# Altium project EMP_Drone_Flight_Controller.PrjPcb
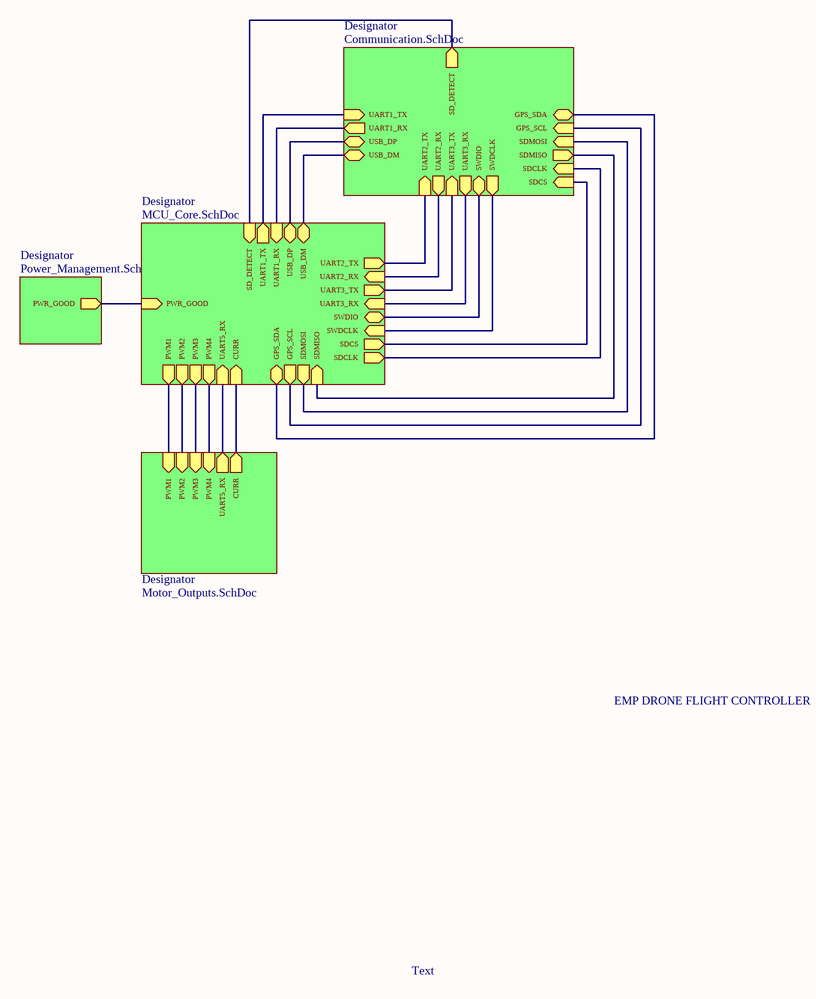
[diagram p0: EMP_FC_Main.SchDoc]
5 sheets, 105 parts. Net scope: hierarchical (ports join the sheet entries above them; power ports are global).
Board file: EMP_FC_PCB1.PcbDoc
Sheets:
  EMP_FC_Main.SchDoc
    Designator = Power_Management.SchDoc
    Designator = MCU_Core.SchDoc
    Designator = Communication.SchDoc
    Designator = Motor_Outputs.SchDoc

## Sheet EMP_FC_Main.SchDoc
size A4; SheetNumber: 1; SheetTotal: 5

### Sub-sheets
Designator = Power_Management.SchDoc: PWR_GOOD (out)
Designator = MCU_Core.SchDoc: UART1_TX (out), UART1_RX (in), USB_DM (bidir), USB_DP (bidir), PWM4 (out), PWM3 (out), PWM2 (out), PWM1 (out), PWR_GOOD (in), UART5_RX (in), UART2_TX (out), UART3_TX (out), SWDIO (bidir), UART2_RX (in), UART3_RX (in), SWDCLK (in), CURR (in), SDCS (out), SDCLK (out), SDMISO (in), SDMOSI (out), GPS_SDA (bidir), GPS_SCL (out), SD_DETECT (in)
Designator = Communication.SchDoc: UART1_TX (in), UART1_RX (out), USB_DP (bidir), USB_DM (bidir), UART2_RX (out), UART3_RX (out), SWDCLK (out), UART2_TX (in), UART3_TX (in), SWDIO (bidir), SDCS (in), SDCLK (in), SDMISO (out), SDMOSI (in), GPS_SCL (in), GPS_SDA (bidir), SD_DETECT (out)
Designator = Motor_Outputs.SchDoc: PWM1 (in), PWM2 (in), PWM3 (in), PWM4 (in), UART5_RX (out), CURR (out)

### Nets
CURR: sheet Designator/CURR, sheet Designator/CURR
D_N: sheet Designator/USB_DM, sheet Designator/USB_DM
D_P: sheet Designator/USB_DP, sheet Designator/USB_DP
GPS_SCL: sheet Designator/GPS_SCL, sheet Designator/GPS_SCL
GPS_SDA: sheet Designator/GPS_SDA, sheet Designator/GPS_SDA
SDCLK: sheet Designator/SDCLK, sheet Designator/SDCLK
SDCS: sheet Designator/SDCS, sheet Designator/SDCS
SDMISO: sheet Designator/SDMISO, sheet Designator/SDMISO
SDMOSI: sheet Designator/SDMOSI, sheet Designator/SDMOSI
SWCLK: sheet Designator/SWDCLK, sheet Designator/SWDCLK
SWDIO: sheet Designator/SWDIO, sheet Designator/SWDIO
UART1_RX: sheet Designator/UART1_RX, sheet Designator/UART1_RX
UART1_TX: sheet Designator/UART1_TX, sheet Designator/UART1_TX
UART2_RX: sheet Designator/UART2_RX, sheet Designator/UART2_RX
UART2_TX: sheet Designator/UART2_TX, sheet Designator/UART2_TX
UART3_RX: sheet Designator/UART3_RX, sheet Designator/UART3_RX
UART3_TX: sheet Designator/UART3_TX, sheet Designator/UART3_TX
UART5_RX: sheet Designator/UART5_RX, sheet Designator/UART5_RX
NetJ8_SWB: sheet Designator/SD_DETECT, sheet Designator/SD_DETECT
NetR8_1: sheet Designator/PWM1, sheet Designator/PWM1
NetR9_1: sheet Designator/PWM2, sheet Designator/PWM2
NetR10_1: sheet Designator/PWM3, sheet Designator/PWM3
NetR11_1: sheet Designator/PWM4, sheet Designator/PWM4
NetU2_98: sheet Designator/PWR_GOOD, sheet Designator/PWR_GOOD

### Notes on the sheet
- EMP DRONE FLIGHT CONTROLLER
- Text

## Sheet Power_Management.SchDoc
size A3; SheetNumber: 2; SheetTotal: 5
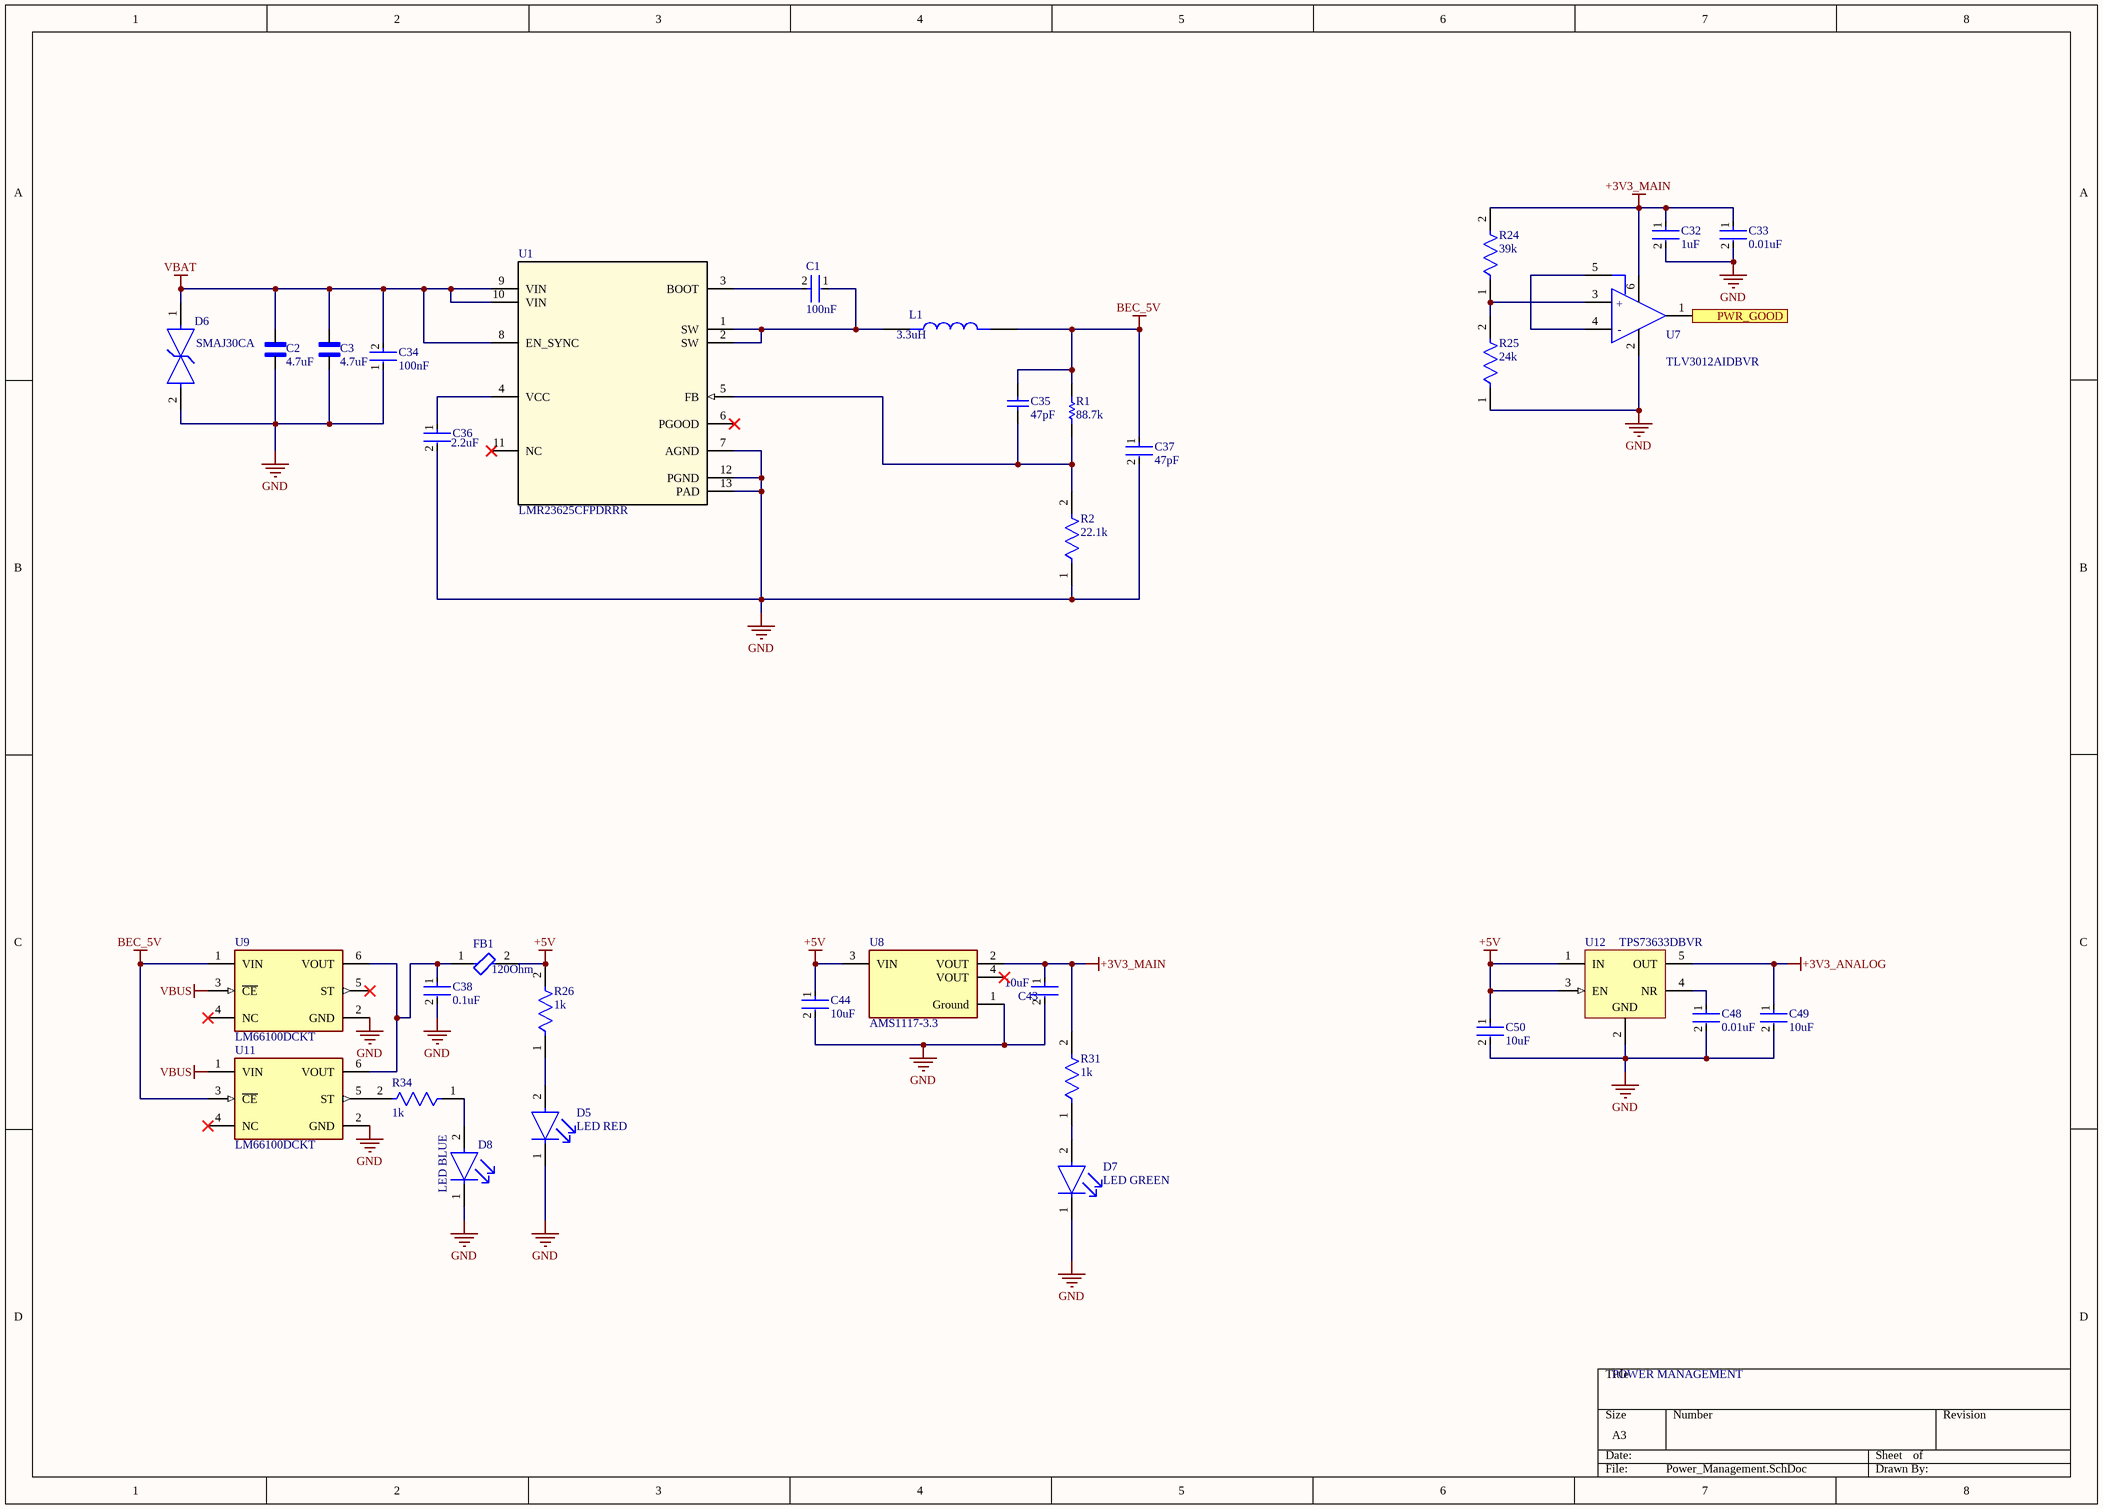
[diagram p1: Power_Management.SchDoc]

### Parts
C1  100nF  [FP-GRM15-MFG]
C2  4.7uF  [CAPC3225X270N]
C3  4.7uF  [CAPC3225X270N]
C32  1uF  [FP-GRM155-0_05-IPC_C]
C33  0.01uF  [FP-GRM022-0_02-IPC_B]
C34  100nF  [FP-C1608-080-0_1-IPC_A]
C35  47pF  [CAPC1005X55X25NL05T10]
C36  2.2uF  [FP-C1005-050-0_05-IPC_A]
C37  47pF  [FP-GRM31C-0_2-e0_3_0_8-IPC_A]
C38  0.1uF  [FP-C0402-BB-MFG]
C43  10uF  [FP-C0402C106M9PACTU-MFG]
C44  10uF  [FP-C0402C106M9PACTU-MFG]
C48  0.01uF  [FP-GRM022-0_02-IPC_B]
C49  10uF  [FP-C0402C106M9PACTU-MFG]
C50  10uF  [FP-C0402C106M9PACTU-MFG]
D5  LED RED  [FP-SML-LXT0805IW-TR-MFG]
D6  SMAJ30CA  [FP-SMAJ-CA-MFG]
D7  LED GREEN  [FP-LTST-C171GKT-MFG]
D8  LED BLUE  [FP-LTST-C191TBKT-MFG]
FB1  120Ohm  [FP-BLM31-0_2-t1_1-MFG]
L1  3.3uH  [IND_XAL4030-332MEB]
R1  88.7k  [RESC1005X40X25NL05T05]
R2  22.1k  [FP-CRCW0402-e3-IPC_A]
R24  39k  [FP-MCS0402-IPC_A]
R25  24k  [FP-CRCW0402-Pe3-IPC_C]
R26  1k  [FP-MCS0402-IPC_A]
R31  1k  [FP-MCS0402-IPC_A]
R34  1k  [FP-MCS0402-IPC_A]
U1  LMR23625CFPDRRR  [DRR0012D]
U7  TLV3012AIDBVR  [FP-DBV0006A-IPC_B]
U8  AMS1117-3.3  [FP-AMS1117-IPC_C]
U9  LM66100DCKT  [FP-DCK0006A-MFG]
U11  LM66100DCKT  [FP-DCK0006A-MFG]
U12  TPS73633DBVR  [DBV0005A_L]

### Ports
PWR_GOOD (out, see EMP_FC_Main[2C], MCU_Core[3B])

### Nets
+3V3_ANALOG: C49.1 U12.5(OUT)
+3V3_MAIN: C32.1 C33.1 C43.1 R24.2 R31.2 U7.6(V+) U8.2(VOUT)
+5V: C44.1 C50.1 FB1.2 R26.2 U8.3(VIN) U12.1(IN) U12.3(EN)
BEC_5V: C35.2 C37.1 L1.2 R1.2 U9.1(VIN) U11.3(~{CE})
GND: C2.1 C3.1 C32.2 C33.2 C34.1 C36.2 C37.2 C38.2 C43.2 C44.2 C48.2 C49.2 C50.2 D5.1(C) D6.2 D7.1(C) D8.1(C) R2.1 R25.1 U1.7(AGND) U1.12(PGND) U1.13(PAD) U7.2(V-) U8.1(Ground) U9.2(GND) U11.2(GND) U12.2(GND)
VBAT: C2.2 C3.2 C34.2 D6.1 U1.8(EN_SYNC) U1.9(VIN) U1.10(VIN)
VBUS: U9.3(~{CE}) U11.1(VIN)
NetC1_1: C1.1 L1.1 U1.1(SW) U1.2(SW)
NetC1_2: C1.2 U1.3(BOOT)
NetC35_1: C35.1 R1.1 R2.2 U1.5(FB)
NetC36_1: C36.1 U1.4(VCC)
NetC38_1: C38.1 FB1.1 U9.6(VOUT) U11.6(VOUT)
NetC48_1: C48.1 U12.4(NR)
NetD5_2: D5.2(A) R26.1
NetD7_2: D7.2(A) R31.1
NetD8_2: D8.2(A) R34.1
NetR24_1: R24.1 R25.2 U7.3(IN+)
NetR34_2: R34.2 U11.5(ST)
NetU2_98: U7.1(OUT) ; port PWR_GOOD
NetU7_4: U7.4(IN-) U7.5(REF)

Not connected (* = marked no-connect by the designer): U1 6(PGOOD)* 11(NC)*; U8 4(VOUT)*; U9 4(NC)* 5(ST)*; U11 4(NC)*

### Notes on the sheet
- POWER MANAGEMENT
- (in symbol CMP-04896-000075-1) +

### Library data of the parts
C1 = CMP-2100-03641-2: CAP CER 0.1UF 16V X7R 0402; Manufacturer Part Number: GRM155R71C104KA88D; Manufacturer: Murata; Standoff Height: 0mm; Tolerance: 10%; Voltage Rating: 16Vdc; Material: Ceramic; Capacitance: 0.10μF; Value: 0.10μF; RoHS: TRUE; Temperature Characteristic: X7R; Octopart: https://octopart.com/grm155r71c104ka88d-murata-196880; Digikey Description: CAP CER 0.1UF 16V X7R 0402; Device Class L3: Ceramic Capacitors; Height: 0.55mm; ComponentLink2Description: Datasheet; Temperature Range Low: -55°C; Ipc Land Pattern Name: CAPC10050X219; ComponentLink2URL: https://search.murata.co.jp/Ceramy/image/img/A01X/G101/ENG/GRM155R71H471KA01-01A.pdf; Device Class L1: Passive Components; Lead Free: yes; Category: Cap; Package: GRM15; Temperature: -55°C to +125°C; Device Class L2: Capacitors; Temperature Range High: +125°C; Mouser Description: 0402 0.1 uF 16V ±10 % Tolerance X7R SMT Multilayer Ceramic Capacitor
C2 C3 = MSASU32MSB7475MPNA01: MF: {'manufacturer': u'Taiyo Yuden'}; Package: None; Price: None; Value: *; MP: MSASU32MSB7475MPNA01; Availability: Unavailable
C32 = CMP-06035-057649-1: Chip Multilayer Ceramic Capacitors for General Purpose, 0402, 1.0uF, B, 10%, 10%, 25V; Capacitance: 1uF; Length: 1mm; Width: 500um; Thickness: 500um; Voltage Rating (DC): 25V; Tolerance: 10%
C33 C48 = CMP-06035-063197-1: Chip Multilayer Ceramic Capacitors for General Purpose, 10000pF ±20%, X6S(EIA), ±22.0%, 4Vdc, 01005 (0402M)
C34 = CMP-08246-002700-1: Multilayer Ceramic Capacitors 100nF ±10% 100V X7S SMD 0603; Depth: 0.8mm; Resistor Type: Ceramic; Lead Free: Lead Free; Case Code (Metric): 1608; Width: 0.031inch; Case Code (Imperial): 0603; Tolerance: 10%; Case/Package: 0603; RoHS Compliant: Yes; Max Operating Temperature: 125°C; Voltage Rating: 100V; Series: C; Length: 1.6mm; Mount: Surface Mount; Min Operating Temperature: -55°C; Weight: 7.1E-05oz; Package Quantity: 4000; Number of Pins: 2; Packaging: Tape and Reel; Thickness: 0.037inch; Termination: SMD/SMT; Dielectric: X7S; Height: 0.8mm; Capacitance: 100nF; REACH SVHC: No SVHC; Voltage Rating (DC): 100V
C35 = CMP-2008-04203-1: Part Number: GRM1555C1E470JA01D; Manufacturer: Murata
C36 = CMP-2000-05998-2: Multilayer Ceramic Capacitors 2.2μF ±10% 16V X5R SMD 0402; REACH SVHC: No SVHC; Series: C; Termination: SMD/SMT; Case Code (Imperial): 0402; Depth: 0.5mm; Mount: Surface Mount; Width: 0.02inch; Package Quantity: 1; Dielectric Material: Ceramic; Length: 1mm; Packaging: Tape and Reel; Case Code (Metric): 1005; RoHS Compliant: Yes; Dielectric: X5R; Max Operating Temperature: 85°C; Lead Free: Lead Free; Weight: 2.3E-05oz; Thickness: 0.022inch; Capacitance: 2.2uF; Voltage Rating (DC): 16V; Tolerance: 10%; Voltage Rating: 16V; Resistor Type: Ceramic; Height: 0.5mm; Case/Package: 0402; Min Operating Temperature: -55°C
C37 = CMP-06035-007919-1: Chip Multilayer Ceramic Capacitors for General Purpose, 1206, 47uF, X5R, 15%, 10%, 10V; Width: 0.063inch; Thickness: 0.071inch; Max Operating Temperature: 85°C; Min Operating Temperature: -55°C; Length: 3.2mm; Case Code (Metric): 3216; Resistor Type: Ceramic; Packaging: Tape and Reel; Weight: 0.001411oz; Case Code (Imperial): 1206; Mount: Surface Mount; Depth: 1.6mm; Capacitance: 47uF; Package Quantity: 6000; Height: 1.6mm; Case/Package: 1206; Tolerance: 10%; Dielectric: X5R; Voltage Rating: 10V; Voltage Rating (DC): 10V; Termination: SMD/SMT
C38 = CMP-1034-02066-3: CAP CER 0.1UF 10V 20% X7R 0402; Manufacturer Part Number: C0402C104M8RACTU; Manufacturer: Kemet; Tolerance: 0.2; Capacitance: 0.10 μF; Value: 0.10 μF; Material: Ceramic; Temperature Coefficient: 15%; Temperature Range Low: -55°C; Device Class L3: Ceramic Capacitors; RoHS: TRUE; Automotive: No; Device Class L2: Capacitors; Temperature Characteristic: X7R; Octopart: https://octopart.com/c0402c104m8ractu-kemet-9144037; Digikey Description: CAP CER 0.1UF 10V 20% X7R 0402; Mouser Description: Multilayer Ceramic Capacitors MLCC - SMD/SMT 10volts 0.1uF X7R 20%; Ipc Land Pattern Name: CAPC10050X50; Voltage Rating: 10 V; Lead Free: Yes; Device Class L1: Passive Components; ComponentLink2URL: https://content.kemet.com/datasheets/KEM_C1002_X7R_SMD.pdf; Category: Cap; ComponentLink2Description: Datasheet; Temperature Range High: +125°C; Height: 0.55mm; Temperature: -55°C to +125°C; Package: C0402-BB
C43 C44 C49 C50 = CMP-03020-034678-1: CAP CER 10UF 6.3V X5R 0402; Tolerance: 20%; Dielectric Material: Ceramic; Voltage Rating: 6.3V; Thickness: 0.028inch; REACH SVHC: No SVHC; RoHS Compliant: Yes; Case Code (Metric): 1005; Lead Free: Lead Free; Length: 0.039inch; Max Operating Temperature: 85°C; Capacitance: 10uF; Voltage Rating (DC): 6.3V; Min Operating Temperature: -55°C; Case/Package: 0402; Mount: Surface Mount; Case Code (Imperial): 0402; Dielectric: X5R; Packaging: Cut Tape; Width: 0.02inch
D5 = CMP-1724-00002-2: LED RED DIFFUSED SMD; Lens Style: Rectangular; Luminous Intensity: 11mcd; Approvals: UL; Test Current: 20mA; Forward Voltage: 2V; Number of LEDs: 1; Wavelength: 635nm; Lens Color: White; Viewing Angle: 140°; Min Operating Temperature: -25°C; Case Code (Metric): 2012; Mount: Surface Mount; Case Code (Imperial): 0805; Height: 0.8mm; Lead Free: Lead Free; Color: Red; Package Quantity: 1; Illumination Color: Red; Lens Transparency: Diffused; Forward Current: 20mA; Packaging: Tape and Reel; Length: 2mm; Case/Package: 0805; REACH SVHC: No SVHC; Width: 1.25mm; Number of Pins: 2; Max Operating Temperature: 80°C; Dominant Wavelength: 635nm
D6 = CMP-2000-07088-2: TVS DIODE 30V 48.4V DO214AC; Breakdown Voltage: 33.3V; Peak Pulse Current: 8.3A; Polarity: Bidirectional; Max Breakdown Voltage: 36.8V; Leakage Current: 1uA; Power Dissipation: 400W; Number of Bidirectional Channels: 1; Element Configuration: Single; Test Current: 1mA; Power Line Protection: No; Max Power Dissipation: 3.3W; Length: 4.5mm; Max Surge Current: 8.3A; Voltage Rating (DC): 30V; Package Quantity: 5000; Composition: Zener; Number of Pins: 2; Clamping Voltage: 48.4V; Termination: SMD/SMT; Width: 2.79mm; Lead Free: Lead Free; Height: 2.087mm; Mount: Surface Mount; REACH SVHC: No SVHC; Number of Channels: 1; Min Operating Temperature: -65°C; Max Reverse Leakage Current: 1uA; Number of Elements: 1; Max Operating Temperature: 150°C; Packaging: Tape and Reel; Peak Pulse Power: 400W; Reverse Breakdown Voltage: 33.3V; Direction: Bidirectional; Min Breakdown Voltage: 33.3V; Reverse Standoff Voltage: 30V; Operating Supply Voltage: 30V; Radiation Hardening: No
D7 = CMP-22017-000007-1: LED GREEN CLEAR CHIP SMD; Luminous Intensity: 12mcd; Lens Color: Colorless; Dominant Wavelength: 569nm; Number of LEDs: 1; Power Dissipation: 100mW; Viewing Angle: 130°; Reverse Voltage: 5V; Test Current: 10mA; Forward Voltage: 2.1V; Wavelength: 585nm; Lens Style: Diffused; Forward Current: 30mA; Height: 0.8mm; Mount: Surface Mount; Package Quantity: 1; Length: 2mm; Case Code (Metric): 2012; Number of Pins: 2; Number of Elements: 1; Packaging: Tape and Reel; Color: Green; Min Operating Temperature: -55°C; Case/Package: 0805; Power Rating: 100mW; Max Operating Temperature: 85°C; Radiation Hardening: No; Depth: 1.25mm; Lens Transparency: Clear; Width: 1.25mm; Lead Free: Lead Free; Case Code (Imperial): 0805; Illumination Color: Green
D8 = CMP-22017-000008-1: LED BLUE CLEAR CHIP SMD; Lens Color: Colorless; Dominant Wavelength: 475nm; Forward Current: 20mA; Wavelength: 468nm; Viewing Angle: 130°; Power Dissipation: 76mW; Luminous Intensity: 180mcd; Reverse Voltage: 5V; Number of Elements: 1; Lens Style: Diffused; Forward Voltage: 3.8V; Max Power Dissipation: 75mW; Case Code (Metric): 1608; Packaging: Tape and Reel; Case/Package: 0603; Depth: 1.6mm; Mount: Surface Mount; Lead Free: Lead Free; Min Operating Temperature: -20°C; Lens Transparency: Clear; Illumination Color: Blue; Height: 0.55mm; Test Current: 20mA; Case Code (Imperial): 0603; Max Operating Temperature: 80°C; Number of Pins: 2; Length: 0.8mm; Radiation Hardening: No; Package Quantity: 1; Number of LEDs: 1; Width: 0.8mm; Color: Blue
FB1 = CMP-0686-00732-3: Chip Ferrite Bead Array, 1206, 120Ω @ 100MHz, 0.02Ω, 25%, 3.5A; Number of Lines: 1; DC Current: 3A; Impedance: 120R; Material: Steel; DC Resistance (DCR): 20mR; Shielding: Unshielded; Number of Pins: 2; Case Code (Metric): 3216; Contact Plating: Tin; Radiation Hardening: No; Termination: SMD/SMT; Lead Free: Lead Free; Core Material: Ferrite; Case Code (Imperial): 1206; Test Frequency: 100MHz; Depth: 1.6mm; Max Operating Temperature: 125°C; Package Quantity: 3000; Packaging: Tape and Reel; Min Operating Temperature: -55°C; Length: 3.2mm; Current Rating: 3.5A; RoHS Compliant: Yes; Tolerance: 25%; Width: 1.6mm; Max Current Rating: 3.5A; Frequency: 100MHz; Military Standard: Not; Case/Package: 1206; Max DC Current: 3A; Height: 1.1mm
L1 = XAL4030-332MEB: Package: None; Price: None; Value: *; MP: XAL4030-332MEB; Availability: Unavailable
R1 = CMP-2002-00251-1: Manufacturer: Vishay Dale; Part Number: CRCW040288K7FKED
R2 = CMP-2002-08380-2: RES Thick Film, 22.1kΩ, 1%, 0.063W, 100ppm/°C, 0402; Voltage Rating: 50V; Resistance: 22.1kR; Power Rating: 63mW; Length: 1mm; Termination: SMD/SMT; Height: 0.35mm; Package Quantity: 10000; Depth: 0.5mm; Lead Free: Lead Free; Packaging: Tape and Reel; Case/Package: 0402; Max Operating Temperature: 155°C; Composition: Thick Film; Min Operating Temperature: -55°C; Working Voltage: 50V; Number of Pins: 2; Contact Plating: Tin; Mount: Surface Mount; Case Code (Imperial): 0402; Temperature Coefficient: 100ppm/°C; Tolerance: 1%; Voltage Rating (DC): 50V; Width: 0.5mm; Number of Terminations: 2; Radiation Hardening: No; Weight: 2.3E-05oz; Military Standard: Not; Case Code (Metric): 1005
R24 = CMP-2002-02506-2: RES SMD 1.2K OHM 1% 1/10W 0402; Tolerance: 0.1%; Max Power Dissipation: 63mW; Resistance: 39kR; Temperature Coefficient: 25ppm/°C; Case/Package: 0402; Number of Terminations: 2; Composition: Thin Film; Max Operating Temperature: 125°C; Packaging: Tape and Reel; Height: 0.015inch; Length: 0.039inch; Lead Free: Lead Free; Min Operating Temperature: -55°C; Package Quantity: 1000; Width: 0.02inch
R25 = CMP-03613-000042-1: RES Thick Film, 24kΩ, 1%, 0.063W, 50ppm/°C, 0402; Max Power Dissipation: 63mW; Resistance: 24kR; Width: 0.02inch; Series: CRCW-P; Length: 0.039inch; Tolerance: 1%; Height: 0.016inch; Packaging: Tape and Reel; Resistor Type: Thick Film; Number of Terminations: 2; Package Quantity: 10000; RoHS Compliant: Yes; Max Operating Temperature: 155°C; Min Operating Temperature: -55°C; Case/Package: 0402; Features: Automotive AEC-Q200; Temperature Coefficient: 50ppm/°C
R26 R31 R34 = CMP-02407-001712-1: RES SMD 1.2K OHM 1% 1/10W 0402; Tolerance: 0.5%; Temperature Coefficient: 25ppm/°C; Max Power Dissipation: 200mW; Resistance: 1kR; Case Code (Metric): 1005; Min Operating Temperature: -55°C; Max Operating Temperature: 175°C; Features: Automotive AEC-Q200; Composition: Thin Film; Case Code (Imperial): 0402; Number of Terminations: 2; Case/Package: 0402; Packaging: Cut Tape
U1 = LMR23625CFPDRRR: SIMPLE SWITCHERÂ®, 36V 2.5A Synchronous Step-Down Converter 12-WSON -40 to 125; Manufacturer_Name: Texas Instruments; TYPE: TYPE; RefDes: RefDes; Copyright: Copyright (C) 2025 Ultra Librarian. All rights reserved.; Manufacturer_Part_Number: LMR23625CFPDRRR; Datasheet: https://www.ti.com/lit/gpn/lmr23625
U7 = CMP-04896-000075-1: IC COMPARATOR 1.8V W/REF SOT23-6; Max Supply Current: 5uA; Max Input Current: 10pA; Number of Elements: 1; Response Time: 6us; Propagation Delay: 13.5us; Max Supply Voltage: 5.5V; Input Offset Voltage (Vos): 12mV; Output Current: 500uA; Power Supply Rejection Ratio (PSRR): 80dB; Common Mode Rejection Ratio: 74dB; Output Type: PUSH-PULL; Max Operating Temperature: 85°C; REACH SVHC: No SVHC; Mount: Surface Mount; Case/Package: SOT-23-6; Min Operating Temperature: -40°C; Min Supply Voltage: 1.8V; Number of Channels: 1; Series: -; Packaging: Tape and Reel; Input Bias Current: 10pA; Lead Free: Lead Free; Number of Pins: 6; Package Quantity: 3000; Nominal Supply Current: 5uA; Radiation Hardening: No; RoHS Compliant: Yes; Contact Plating: Gold; Supply Current: 5uA; Quiescent Current: 5uA
U8 = CMP-209535-000001-1: LDO Voltage Regulators 1A, 3.3V; Manufacturer: Advanced Monolithic Systems; Dropout Voltage: 1.1V; Output Type: Fixed; Nominal Supply Current: 5mA; Max Power Dissipation: 1.2W; Max Supply Voltage: 15V; Number Of Outputs: 1; Standoff Height: 0.64mm; Max Junction Temp: +125°C; Height: 1.8mm; Package: AMS1117; Device Class L2: Power Management ICs; ComponentLink2Description: Datasheet; ComponentLink2URL: http://www.advanced-monolithic.com/pdf/ds1117.pdf; Category: IC; RoHS: TRUE; Automotive: No; Device Class L1: Integrated Circuits (ICs); Output Current: 1A; Device Class L3: Voltage Regulators - Linear; Temperature: -40°C to +125°C; Output Voltage: 3.3V; Manufacturer Part Number: AMS1117-3.3; Temperature Range Low: -40°C; Octopart: https://octopart.com/ams1117-3.3-advanced+monolithic+systems-25899300; Lead Free: Yes; Ipc Land Pattern Name: SOT229P700X180-4; Temperature Range High: +125°C
U9 U11 = CMP-04910-000059-1: IC OR CTRLR IDEAL DIODE SC70-6
U12 = CMP-0395-00256-2: Single Output Low Noise LDO, 400 mA, Fixed 3.3 V Output, 1.7 to 5.5 V Input, with Reverse Current Protection, 5-pin SOT-23 (DBV), -40 to 85 degC, Green (RoHS & no Sb/Br); Manufacturer: Texas Instruments; Vin(Min)(V): 1.7; Vdo(Typ)(mV): 75; Iq(Typ)(mA): 0.3; SubFamily: Single Channel LDO; Vout Adj(Max)(V): 3.3; Accuracy(%): 1; Vin(Max)(V): 5.5; Iout(Max)(A): 0.4; Rating: Catalog; ComponentLink1Description: Manufacturer URL; PartNumber: TPS73633DBVR; PackageDescription: 5-Pin Plastic Small Outline, Body 1.60 Ãƒâ€” 2.90 mm, Pitch 0.95 mm; ComponentLink3URL: http://www.ti.com/litv/pdf/mpds018i; ComponentLink2Description: Datasheet; ComponentLink4Description: URL Link1; DatasheetVersion: SBVS038T; Vout Adj(Min)(V): 3.3; Code_JEDEC: MO-178; Fixed Output Options(V): 3.3; Eco-Plan: Green (RoHS & no Sb/Br); PackageReference: DBV0005A; ComponentLink4URL: Samples URL:http://www.ti.com/product/tps73633#samples; PackageVersion: 4073253-4/K; ComponentLink2URL: http://www.ti.com/general/docs/lit/getliterature.tsp?genericPartNumber=TPS73633&fileType=pdf; ComponentLink1URL: http://www.ti.com/; ComponentLink3Description: Package Specification; Mounting Technology: Surface Mount

## Sheet MCU_Core.SchDoc
size A3; SheetNumber: 3; SheetTotal: 5
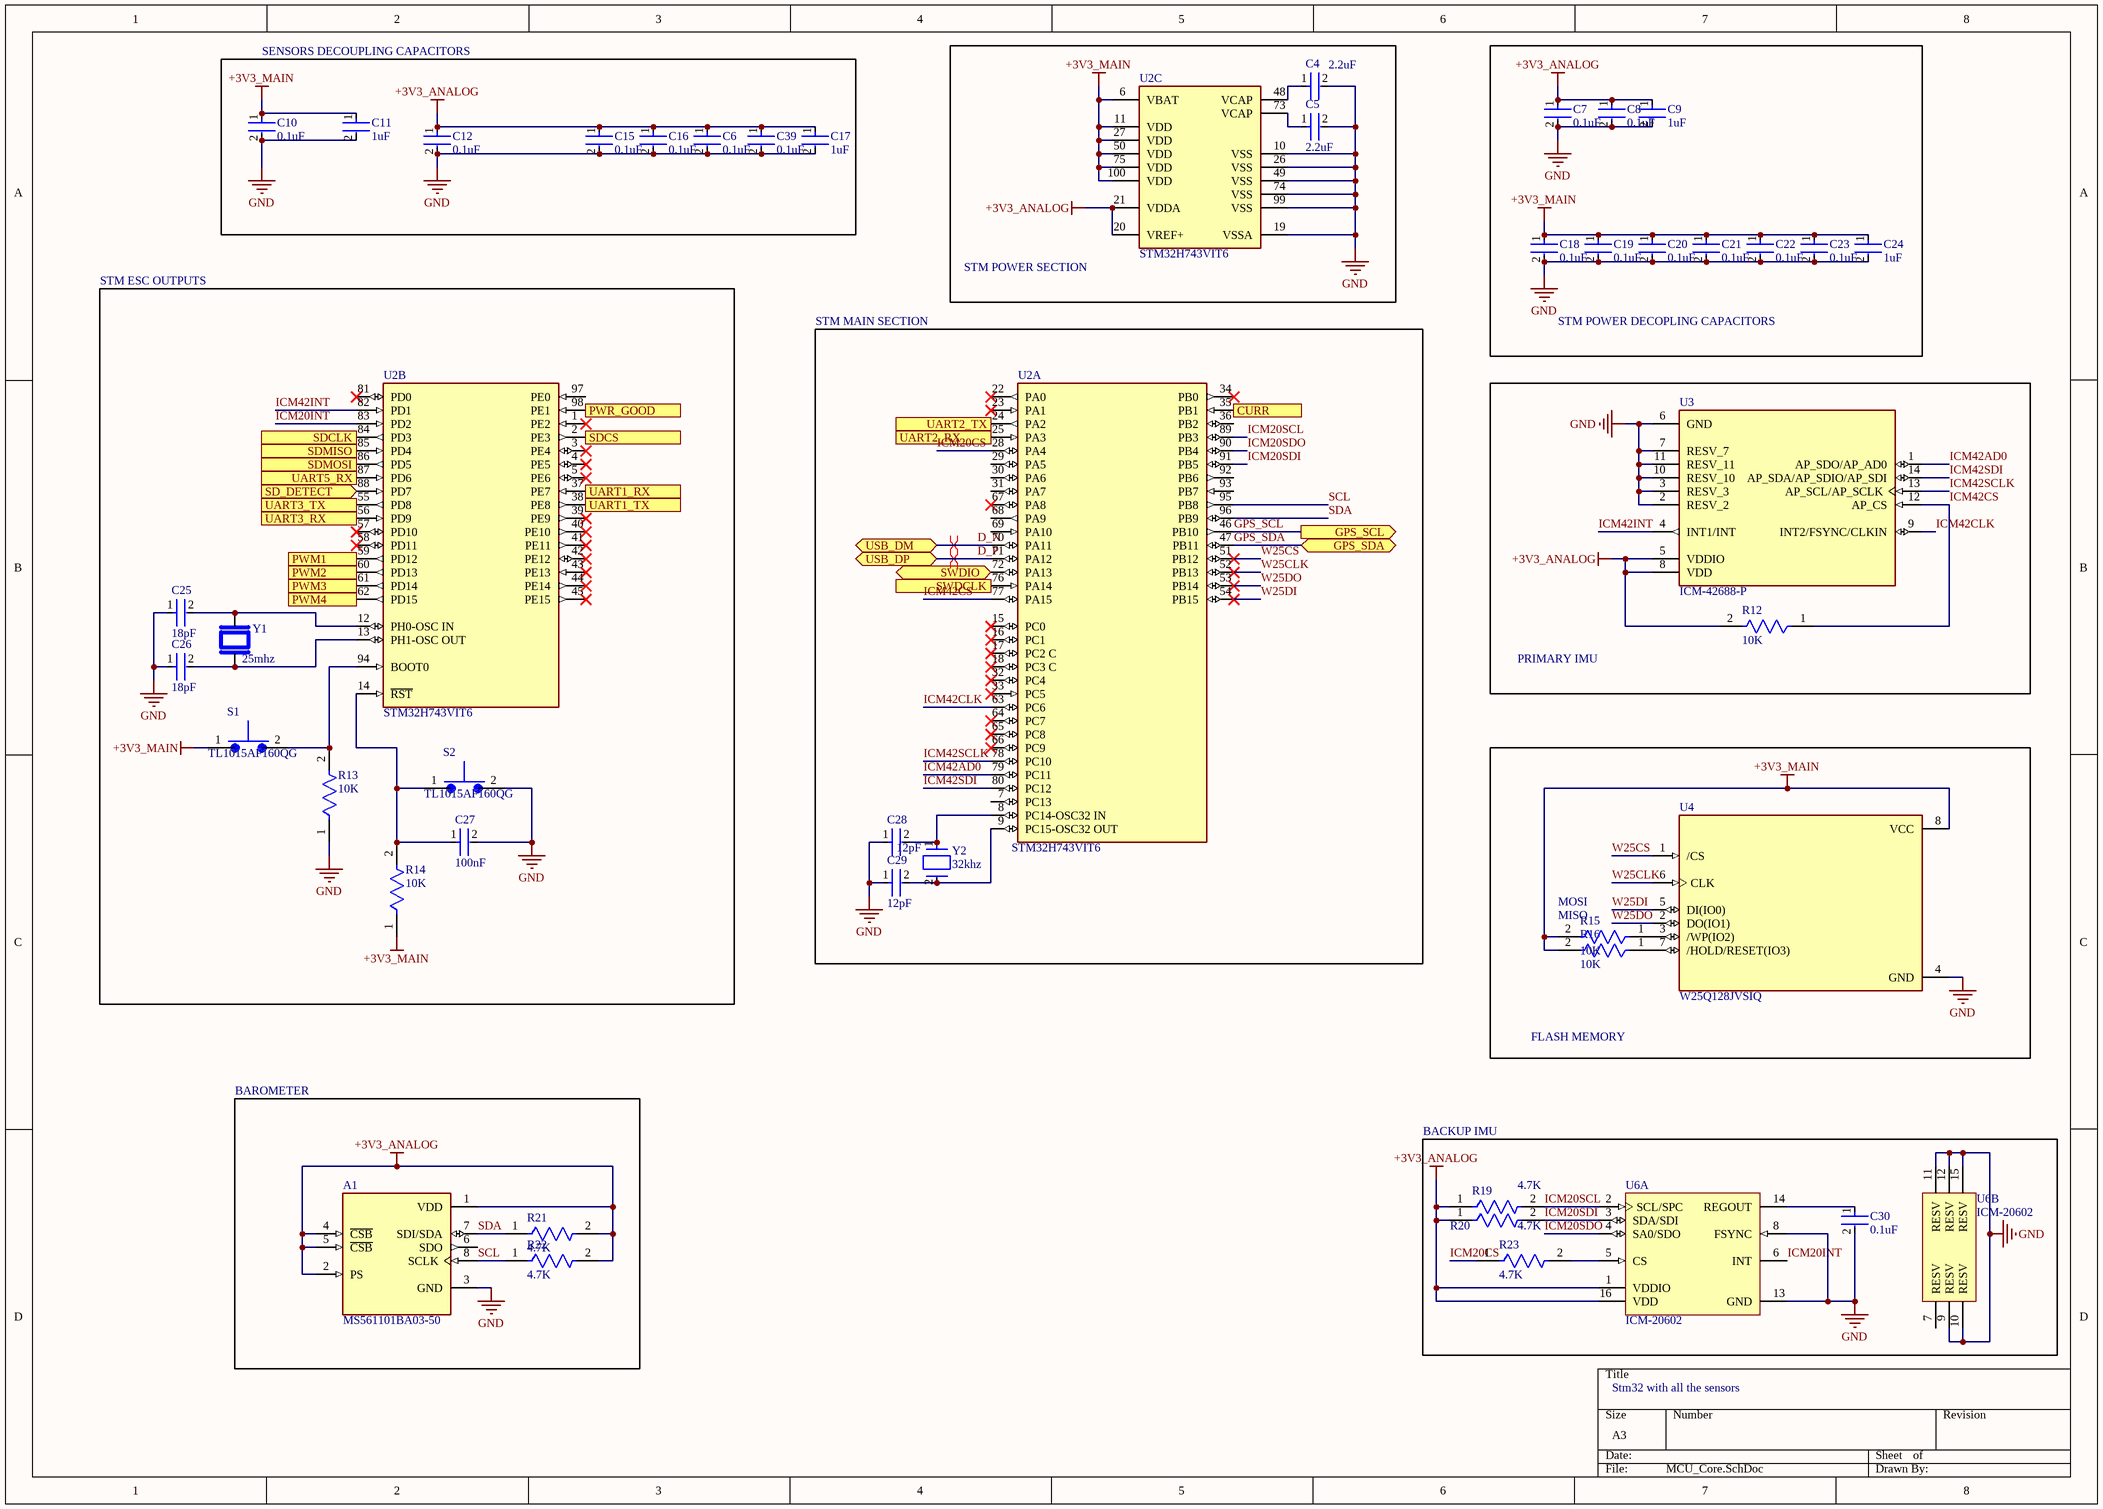
[diagram p2: MCU_Core.SchDoc]

### Parts
A1  MS561101BA03-50  [XDCR_MS561101BA03-50]
C4  2.2uF  [FP-GRM155-0_15-IPC_A]
C5  2.2uF  [FP-GRM155-0_15-IPC_A]
C6  0.1uF  [FP-C0402-BB-MFG]
C7  0.1uF  [FP-C0402-BB-MFG]
C8  0.1uF  [FP-C0402-BB-MFG]
C9  1uF  [FP-GRM152-0_05-MFG]
C10  0.1uF  [FP-C0402-BB-MFG]
C11  1uF  [FP-GRM152-0_05-MFG]
C12  0.1uF  [FP-C0402-BB-MFG]
C15  0.1uF  [FP-C0402-BB-MFG]
C16  0.1uF  [FP-C0402-BB-MFG]
C17  1uF  [FP-GRM152-0_05-MFG]
C18  0.1uF  [FP-C0402-BB-MFG]
C19  0.1uF  [FP-C0402-BB-MFG]
C20  0.1uF  [FP-C0402-BB-MFG]
C21  0.1uF  [FP-C0402-BB-MFG]
C22  0.1uF  [FP-C0402-BB-MFG]
C23  0.1uF  [FP-C0402-BB-MFG]
C24  1uF  [FP-GRM152-0_05-MFG]
C25  18pF  [FP-C0402-BB-MFG]
C26  18pF  [FP-C0402-BB-MFG]
C27  100nF  [FP-C0402-BB-MFG]
C28  12pF  [FP-C0402-BB-MFG]
C29  12pF  [FP-C0402-BB-MFG]
C30  0.1uF  [FP-C0402-BB-MFG]
C39  0.1uF  [FP-C0402-BB-MFG]
R12  10K  [FP-MCS0402-MFG]
R13  10K  [FP-MCS0402-MFG]
R14  10K  [FP-MCS0402-MFG]
R15  10K  [FP-MCS0402-MFG]
R16  10K  [FP-MCS0402-MFG]
R19  4.7K  [FP-CRCW0402-Pe3-IPC_C]
R20  4.7K  [FP-CRCW0402-Pe3-IPC_C]
R21  4.7K  [FP-CRCW0402-Pe3-IPC_C]
R22  4.7K  [FP-CRCW0402-Pe3-IPC_C]
R23  4.7K  [FP-CRCW0402-Pe3-IPC_C]
S1  TL1015AF160QG  [SW_TL1015AF160QG]
S2  TL1015AF160QG  [SW_TL1015AF160QG]
U2  STM32H743VIT6  [FP-LQFP100-1L-MFG]  (parts A,B,C of 3)
U3  ICM-42688-P  [PQFN50P300X250X97-14N]
U4  W25Q128JVSIQ  [SOIC127P790X216-8N]
U6  ICM-20602  [INSE-I62-16]  (parts A,B of 2)
Y1  25mhz  [XTAL_SXT32412BB07-25.000MT]
Y2  32khz  [FP-ABS07-MFG]

### Blocks framed on the sheet
SENSORS DECOUPLING CAPACITORS: C6 C10-C12 C15-C17 C39
STM POWER SECTION: C4 C5 U2
STM POWER DECOPLING CAPACITORS: C7-C9 C18-C24
STM ESC OUTPUTS: C25-C27 R13 R14 S1 S2 U2 Y1
STM MAIN SECTION: C28 C29 U2 Y2
PRIMARY IMU: R12 U3
BAROMETER: A1 R21 R22
BACKUP IMU: C30 R19 R20 R23 U6

### Ports
CURR (in, see EMP_FC_Main[2C], Motor_Outputs[3B]), GPS_SCL (out, see EMP_FC_Main[2C], Communication[6A]), GPS_SDA (bidir, see EMP_FC_Main[2C], Communication[6A]), PWM1 (out, see EMP_FC_Main[2C], Motor_Outputs[1B]), PWM2 (out, see EMP_FC_Main[2C], Motor_Outputs[1C]), PWM3 (out, see EMP_FC_Main[2C], Motor_Outputs[1C]), PWM4 (out, see EMP_FC_Main[2C], Motor_Outputs[1C]), PWR_GOOD (in, see EMP_FC_Main[2C], Power_Management[7A]), SD_DETECT (in, see EMP_FC_Main[2B], Communication[2C]), SDCLK (out, see EMP_FC_Main[3C], Communication[2C]), SDCS (out, see EMP_FC_Main[3C], Communication[2C]), SDMISO (in, see EMP_FC_Main[3C], Communication[2C]), SDMOSI (out, see EMP_FC_Main[2C], Communication[2C]), SWDCLK (in, see EMP_FC_Main[3C], Communication[4C]), SWDIO (bidir, see EMP_FC_Main[3C], Communication[4C]), UART1_RX (in, see EMP_FC_Main[2B], Communication[4A]), UART1_TX (out, see EMP_FC_Main[2B], Communication[4A]), UART2_RX (in, see EMP_FC_Main[3B], Communication[5C]), UART2_TX (out, see EMP_FC_Main[3B], Communication[5C]), UART3_RX (in, see EMP_FC_Main[3C], Communication[6A]), UART3_TX (out, see EMP_FC_Main[3B], Communication[6A]), UART5_RX (in, see EMP_FC_Main[2C], Motor_Outputs[4B]), USB_DM (bidir, see EMP_FC_Main[2B], Communication[2A]), USB_DP (bidir, see EMP_FC_Main[2B], Communication[2A])

### Nets
+3V3_ANALOG: A1.1(VDD) A1.2(PS) A1.4(~{CSB}) A1.5(~{CSB}) C6.1 C7.1 C8.1 C9.1 C12.1 C15.1 C16.1 C17.1 C39.1 R12.2 R19.1 R20.1 R21.2 R22.2 U2.20(VREF+) U2.21(VDDA) U3.5(VDDIO) U3.8(VDD) U6.1(VDDIO) U6.16(VDD)
+3V3_MAIN: C10.1 C11.1 C18.1 C19.1 C20.1 C21.1 C22.1 C23.1 C24.1 R14.1 R15.2 R16.2 S1.1 U2.6(VBAT) U2.11(VDD) U2.27(VDD) U2.50(VDD) U2.75(VDD) U2.100(VDD) U4.8(VCC)
GND: A1.3(GND) C4.2 C5.2 C6.2 C7.2 C8.2 C9.2 C10.2 C11.2 C12.2 C15.2 C16.2 C17.2 C18.2 C19.2 C20.2 C21.2 C22.2 C23.2 C24.2 C25.1 C26.1 C27.2 C28.1 C29.1 C30.2 C39.2 R13.1 S2.2 U2.10(VSS) U2.19(VSSA) U2.26(VSS) U2.49(VSS) U2.74(VSS) U2.99(VSS) U3.2(RESV_2) U3.3(RESV_3) U3.6(GND) U3.7(RESV_7) U3.10(RESV_10) U3.11(RESV_11) U4.4(GND) U6.8(FSYNC) U6.9(RESV) U6.10(RESV) U6.11(RESV) U6.12(RESV) U6.13(GND) U6.15(RESV)
CURR: U2.35(PB1) ; port CURR
D_N: U2.70(PA11) ; port USB_DM
D_P: U2.71(PA12) ; port USB_DP
GPS_SCL: U2.46(PB10) ; port GPS_SCL
GPS_SDA: U2.47(PB11) ; port GPS_SDA
ICM20CS: R23.1 U2.28(PA4)
ICM20INT: U2.83(PD2) U6.6(INT)
ICM20SCL: R19.2 U2.89(PB3) U6.2(SCL/SPC)
ICM20SDI: R20.2 U2.91(PB5) U6.3(SDA/SDI)
ICM20SDO: U2.90(PB4) U6.4(SA0/SDO)
ICM42AD0: U2.79(PC11) U3.1(AP_SDO/AP_AD0)
ICM42CLK: U2.63(PC6) U3.9(INT2/FSYNC/CLKIN)
ICM42CS: R12.1 U2.77(PA15) U3.12(AP_CS)
ICM42INT: U2.82(PD1) U3.4(INT1/INT)
ICM42SCLK: U2.78(PC10) U3.13(AP_SCL/AP_SCLK)
ICM42SDI: U2.80(PC12) U3.14(AP_SDA/AP_SDIO/AP_SDI)
SCL: A1.8(SCLK) R22.1 U2.95(PB8)
SDA: A1.7(SDI/SDA) R21.1 U2.96(PB9)
SDCLK: U2.84(PD3) ; port SDCLK
SDCS: U2.2(PE3) ; port SDCS
SDMISO: U2.85(PD4) ; port SDMISO
SDMOSI: U2.86(PD5) ; port SDMOSI
SWCLK: U2.76(PA14) ; port SWDCLK
SWDIO: U2.72(PA13) ; port SWDIO
UART1_RX: U2.37(PE7) ; port UART1_RX
UART1_TX: U2.38(PE8) ; port UART1_TX
UART2_RX: U2.25(PA3) ; port UART2_RX
UART2_TX: U2.24(PA2) ; port UART2_TX
UART3_RX: U2.56(PD9) ; port UART3_RX
UART3_TX: U2.55(PD8) ; port UART3_TX
UART5_RX: U2.87(PD6) ; port UART5_RX
W25CLK: U2.52(PB13) U4.6(CLK)
W25CS: U2.51(PB12) U4.1(/CS)
W25DI: U2.54(PB15) U4.5(DI(IO0))
W25DO: U2.53(PB14) U4.2(DO(IO1))
NetC4_1: C4.1 U2.48(VCAP)
NetC5_1: C5.1 U2.73(VCAP)
NetC25_2: C25.2 U2.12(PH0-OSC_IN) Y1.3
NetC26_2: C26.2 U2.13(PH1-OSC_OUT) Y1.1
NetC27_1: C27.1 R14.2 S2.1 U2.14(~{RST})
NetC28_2: C28.2 U2.8(PC14-OSC32_IN) Y2.1
NetC29_2: C29.2 U2.9(PC15-OSC32_OUT) Y2.2
NetC30_1: C30.1 U6.14(REGOUT)
NetJ8_SWB: U2.88(PD7) ; port SD_DETECT
NetR8_1: U2.59(PD12) ; port PWM1
NetR9_1: U2.60(PD13) ; port PWM2
NetR10_1: U2.61(PD14) ; port PWM3
NetR11_1: U2.62(PD15) ; port PWM4
NetR13_2: R13.2 S1.2 U2.94(BOOT0)
NetR15_1: R15.1 U4.3(/WP(IO2))
NetR16_1: R16.1 U4.7(/HOLD/RESET(IO3))
NetR23_2: R23.2 U6.5(CS)
NetU2_98: U2.98(PE1) ; port PWR_GOOD

Not connected (* = marked no-connect by the designer): A1 6(SDO); U2 1(PE2)* 3(PE4)* 4(PE5)* 5(PE6)* 7(PC13) 15(PC0)* 16(PC1)* 17(PC2_C)* 18(PC3_C)* 22(PA0)* 23(PA1)* 29(PA5) 30(PA6) 31(PA7) 32(PC4)* 33(PC5)* 34(PB0)* 36(PB2) 39(PE9)* 40(PE10)* 41(PE11)* 42(PE12)* 43(PE13)* 44(PE14)* 45(PE15)* 57(PD10)* 58(PD11)* 64(PC7)* 65(PC8)* 66(PC9)* 67(PA8)* 68(PA9) 69(PA10) 81(PD0)* 92(PB6) 93(PB7) 97(PE0); U6 7(RESV)

### Layout directives
differential pair: D_N, D_P

### Notes on the sheet
- MOSI
- (near R15) MISO
- FLASH MEMORY
- Stm32 with all the sensors

### Library data of the parts
A1 = MS561101BA03-50: Sensor;MS5611-BT M-CAPS 3X5X1MM T&R;Pressure;MS561101BA03-50 | TE Connectivity MS561101BA03-50; SnapEDA_Link: https://www.snapeda.com/parts/MS561101BA03-50/TE+Connectivity+ALCOSWITCH+Switches/view-part/?ref=snap; Package: SMD-8 Measurement Specialties; Value: *; MF: TE Connectivity; MP: MS561101BA03-50; Check_prices: https://www.snapeda.com/parts/MS561101BA03-50/TE+Connectivity+ALCOSWITCH+Switches/view-part/?ref=eda
C4 C5 = CMP-06035-048202-1: Chip Multilayer Ceramic Capacitors for General Purpose, 0402, 2.2uF, X7R, 15%, 10%, 10V
C6-C8 C10 C12 C15 C16 C18-C23 C27 C30 C39 = CMP-03020-002733-1: CAP CER 0.1UF 10V X7R 0402; Manufacturer: Kemet; Manufacturer Part Number: C0402C104K8RACAUTO; Material: Ceramic; Value: 0.10 μF; Tolerance: 0.1; Temperature Coefficient: 15%; ComponentLink2Description: Datasheet; Automotive: No; Digikey Description: CAP CER 0.1UF 10V X7R 0402; Temperature Range Low: -55°C; Ipc Land Pattern Name: CAPC10050X50; Lead Free: Yes; Category: Cap; Package: C0402-BB; Octopart: https://octopart.com/c0402c104k8racauto-kemet-9145167; Voltage Rating: 10 V; Device Class L2: Capacitors; Capacitance: 0.10 μF; Temperature Range High: +125°C; Height: 0.55mm; ComponentLink2URL: https://content.kemet.com/datasheets/KEM_C1002_X7R_SMD.pdf; Temperature: -55°C to +125°C; Device Class L1: Passive Components; Temperature Characteristic: X7R; RoHS: TRUE; Device Class L3: Ceramic Capacitors
C9 C11 C17 C24 = CMP-06035-048608-1: Chip Multilayer Ceramic Capacitors for General Purpose, 0402, 1.0uF, X5R, 15%, 20%, 6.3V; Case Code (Metric): 1005; Length: 0.039inch; Mount: Surface Mount; Width: 0.02inch; Voltage Rating (DC): 6.3V; Tolerance: 20%; Thickness: 0.009inch; Dielectric: X5R; Min Operating Temperature: -55°C; Max Operating Temperature: 85°C; Case/Package: 0402; Packaging: Tape and Reel; Case Code (Imperial): 0402; Voltage Rating: 6.3V; Capacitance: 1uF
C25 C26 = CMP-03020-024161-1: C0402 18 pF X8R 5.00% 50 V; Manufacturer: Kemet; Manufacturer Part Number: C0402C180J5HACAUTO; Material: Ceramic; Temperature Coefficient: 15%; Tolerance: 0.05; Voltage Rating: 50 V; Temperature Range Low: -55°C; Octopart: https://octopart.com/c0402c180j5hacauto-kemet-88080534; Device Class L1: Passive Components; Automotive: No; ComponentLink2Description: Datasheet; RoHS: TRUE; Category: Cap; Package: C0402-BB; Temperature Characteristic: X8R; Ipc Land Pattern Name: CAPC10050X50; Temperature Range High: +125°C; Value: 18 pF; Capacitance: 18 pF; Device Class L3: Ceramic Capacitors; ComponentLink2URL: https://content.kemet.com/datasheets/KEM_C1002_X7R_SMD.pdf; Height: 0.55mm; Device Class L2: Capacitors; Temperature: -55°C to +125°C; Lead Free: Yes
C28 C29 = CMP-03020-024996-1: C0402 12 pF X8R 5.00% 50 V; Manufacturer: Kemet; Manufacturer Part Number: C0402C120J5HACTU; Tolerance: 0.05; Temperature Coefficient: 15%; Voltage Rating: 50 V; Material: Ceramic; Device Class L2: Capacitors; Temperature Range Low: -55°C; Temperature Range High: +125°C; Temperature Characteristic: X8R; Device Class L3: Ceramic Capacitors; ComponentLink2Description: Datasheet; Capacitance: 12 pF; Height: 0.55mm; Category: Cap; Package: C0402-BB; Ipc Land Pattern Name: CAPC10050X50; RoHS: TRUE; Lead Free: Yes; Automotive: No; Octopart: https://octopart.com/c0402c120j5hactu-kemet-88724098; Temperature: -55°C to +125°C; Device Class L1: Passive Components; Value: 12 pF; ComponentLink2URL: https://content.kemet.com/datasheets/KEM_C1002_X7R_SMD.pdf
R12-R16 = CMP-02407-000363-1: RES SMD 1.2K OHM 1% 1/10W 0402; Power Rating: 100mW; Temperature Coefficient: 25ppm/°C; Tolerance: 0.5%; Voltage Rating: 50V; Resistance: 10kR; Package Quantity: 10000; Case Code (Metric): 1005; Height: 0.015inch; Termination: SMD/SMT; Features: Automotive AEC-Q200; Packaging: Tape and Reel; Length: 0.039inch; Min Operating Temperature: -55°C; Case/Package: 0402; Max Power Dissipation: 100mW; Case Code (Imperial): 0402; Width: 0.5mm; Contact Plating: Tin; Weight: 2.1E-05oz; Max Operating Temperature: 175°C; Composition: Thin Film; Number of Terminations: 2; Radiation Hardening: No
R19-R23 = CMP-03613-000096-1: RES Thick Film, 4.7kΩ, 1%, 0.063W, 50ppm/°C, 0402; Resistance: 4.7kR; Max Power Dissipation: 63mW; Tolerance: 1%; Package Quantity: 10000; Case/Package: 0402; Max Operating Temperature: 155°C; RoHS Compliant: Yes; Series: CRCW-P; Resistor Type: Thick Film; Number of Terminations: 2; Min Operating Temperature: -55°C; Temperature Coefficient: 50ppm/°C; Features: Automotive AEC-Q200; Length: 0.039inch; Height: 0.016inch; Width: 0.02inch; Packaging: Tape and Reel
S1 S2 = TL1015AF160QG: Tactile Switch SPST-NO Top Actuated Surface Mount; Package: None; Availability: Unavailable; Value: *; MP: TL1015AF160QG; Price: None
U2 = CMP-12105-000050-1: IC MCU 32BIT 2MB FLASH 100LQFP; Manufacturer: STMicroelectronics; Number Of Ethernet Channels: 1; Number Of Usb Channels: 2; Number Of A/D Converters: 3; Min Supply Voltage: 1.71V; Ram Size: 1060KBytes; Number Of I2C Channels: 4; Frequency: 480MHz; Number Of Adc Channels: 36; Number Of I/Os: 82; Max Supply Voltage: 3.6V; Number Of Spi Channels: 6; Memory Size: 2MBytes; Max Junction Temp: +125°C; Core Architecture: Arm Cortex-M7; Interface: I2C,SPI,UART,USART,USB,LIN,IrDA,Ethernet,I2S,Other; Number Of Timers/Counters: 20; Data Bus Width: 32bits; Number Of Pwm Channels: 42; Number Of Uart Channels: 9; Standoff Height: 0.05mm; Device Class L1: Integrated Circuits (ICs); ComponentLink2URL: https://www.st.com/resource/en/datasheet/stm32h743vi.pdf; Automotive: No; Memory Type: FLASH; Number Of Cores: 1; Temperature Range Low: -40°C; RoHS: TRUE; Ambient Temperature Range Low: -40°C; ComponentLink2Description: Datasheet; Device Class L2: Embedded Processors and Controllers; Device Class L3: Microcontrollers; Digikey Description: IC MCU 32BIT 2MB FLASH 100LQFP; Temperature Range High: +125°C; Ambient Temperature Range High: +85°C; Package: LQFP100-1L; Temperature: -40°C to +125°C; Category: IC; Ipc Land Pattern Name: QFP50P1600X1600X160-100; Height: 1.6mm; Manufacturer Part Number: STM32H743VIT6; Octopart: https://octopart.com/stm32h743vit6-stmicroelectronics-76372527; Lead Free: Yes
U3 = ICM-42688-P: Accelerometer, Gyroscope, 6 Axis Sensor Output; Package: None; MP: ICM-42688-P; Value: *; Availability: Unavailable; Price: None
U4 = W25Q128JVSIQ: FLASH - NOR Memory IC 128Mb (16M x 8) SPI - Quad I/O, QPI, DTR 133 MHz 8-SOIC; MF: Winbond Electronics; SnapEDA_Link: https://www.snapeda.com/parts/W25Q128JVSIQ/Winbond/view-part/?ref=snap; Package: SOIC-8 Winbond Electronics; Value: *; MP: W25Q128JVSIQ; Check_prices: https://www.snapeda.com/parts/W25Q128JVSIQ/Winbond/view-part/?ref=eda
U6 = CMP-2000-07589-1: High Performance 6-Axis MEMS MotionTracking(TM) Device, 1.71 to 3.45 V, -40 to 85 degC, 16-Pin LGA, RoHS; Manufacturer: InvenSense; Sensor Type: Temperature; Output Type: I2C; RoHSCompliant: True; Datasheet Version: Rev. 1.0, 10/2016; Datasheet URL: http://www.invensense.com/wp-content/uploads/2016/10/DS-000176-ICM-20602-v1.0.pdf; Min Operating Temperature: -40degC; Mounting Technology: SurfaceMount; Max Operating Temperature: 85degC; Manufacturer URL: http://www.invensense.com/; Package Reference: I62-16; Package Description: 16-Pin Land Grid Array, Body 3 x 3 mm, Pitch 0.5 mm
Y1 = SXT32412BB07-25.000MT: 25 MHz Â±30ppm Crystal 12pF 50 Ohms 4-SMD, No Lead; MF: Suntsu; SnapEDA_Link: https://www.snapeda.com/parts/SXT32412BB07-25.000M/Suntsu/view-part/?ref=snap; Package: NON STANDARD-4 Suntsu; Value: *; MP: SXT32412BB07-25.000M; Check_prices: https://www.snapeda.com/parts/SXT32412BB07-25.000M/Suntsu/view-part/?ref=eda; Supplier 1: DigiKey; Supplier Part Number 1: 535-ABM8N-25.0000MHZ-12-B1U-T3CT-ND
Y2 = CMP-0447-00001-4: Crystal 32.768kHz ±20ppm (Tol) 12.5pF FUND 70kΩ 2-Pin CSMD T/R; ESR (Equivalent Series Resistance): 70kR; Radiation Hardening: No; Frequency: 32.768kHz; Length: 3.2mm; Max Operating Temperature: 85°C; Number of Pins: 2; Series: ABS07; Min Operating Temperature: -40°C; Frequency Tolerance: 20ppm; Packaging: Tape and Reel; Height: 0.9mm; Width: 1.5mm; Depth: 1.5mm; Load Capacitance: 12.5pF; RoHS Compliant: Yes; Tolerance: 20ppm; Termination: SMD/SMT; Lead Free: Lead Free; Series Resistance: 70kR; REACH SVHC: No SVHC; Case/Package: CSMD; Operating Frequency: 32.768 kHz; Package Quantity: 3000

## Sheet Communication.SchDoc
size A3; SheetNumber: 4; SheetTotal: 5
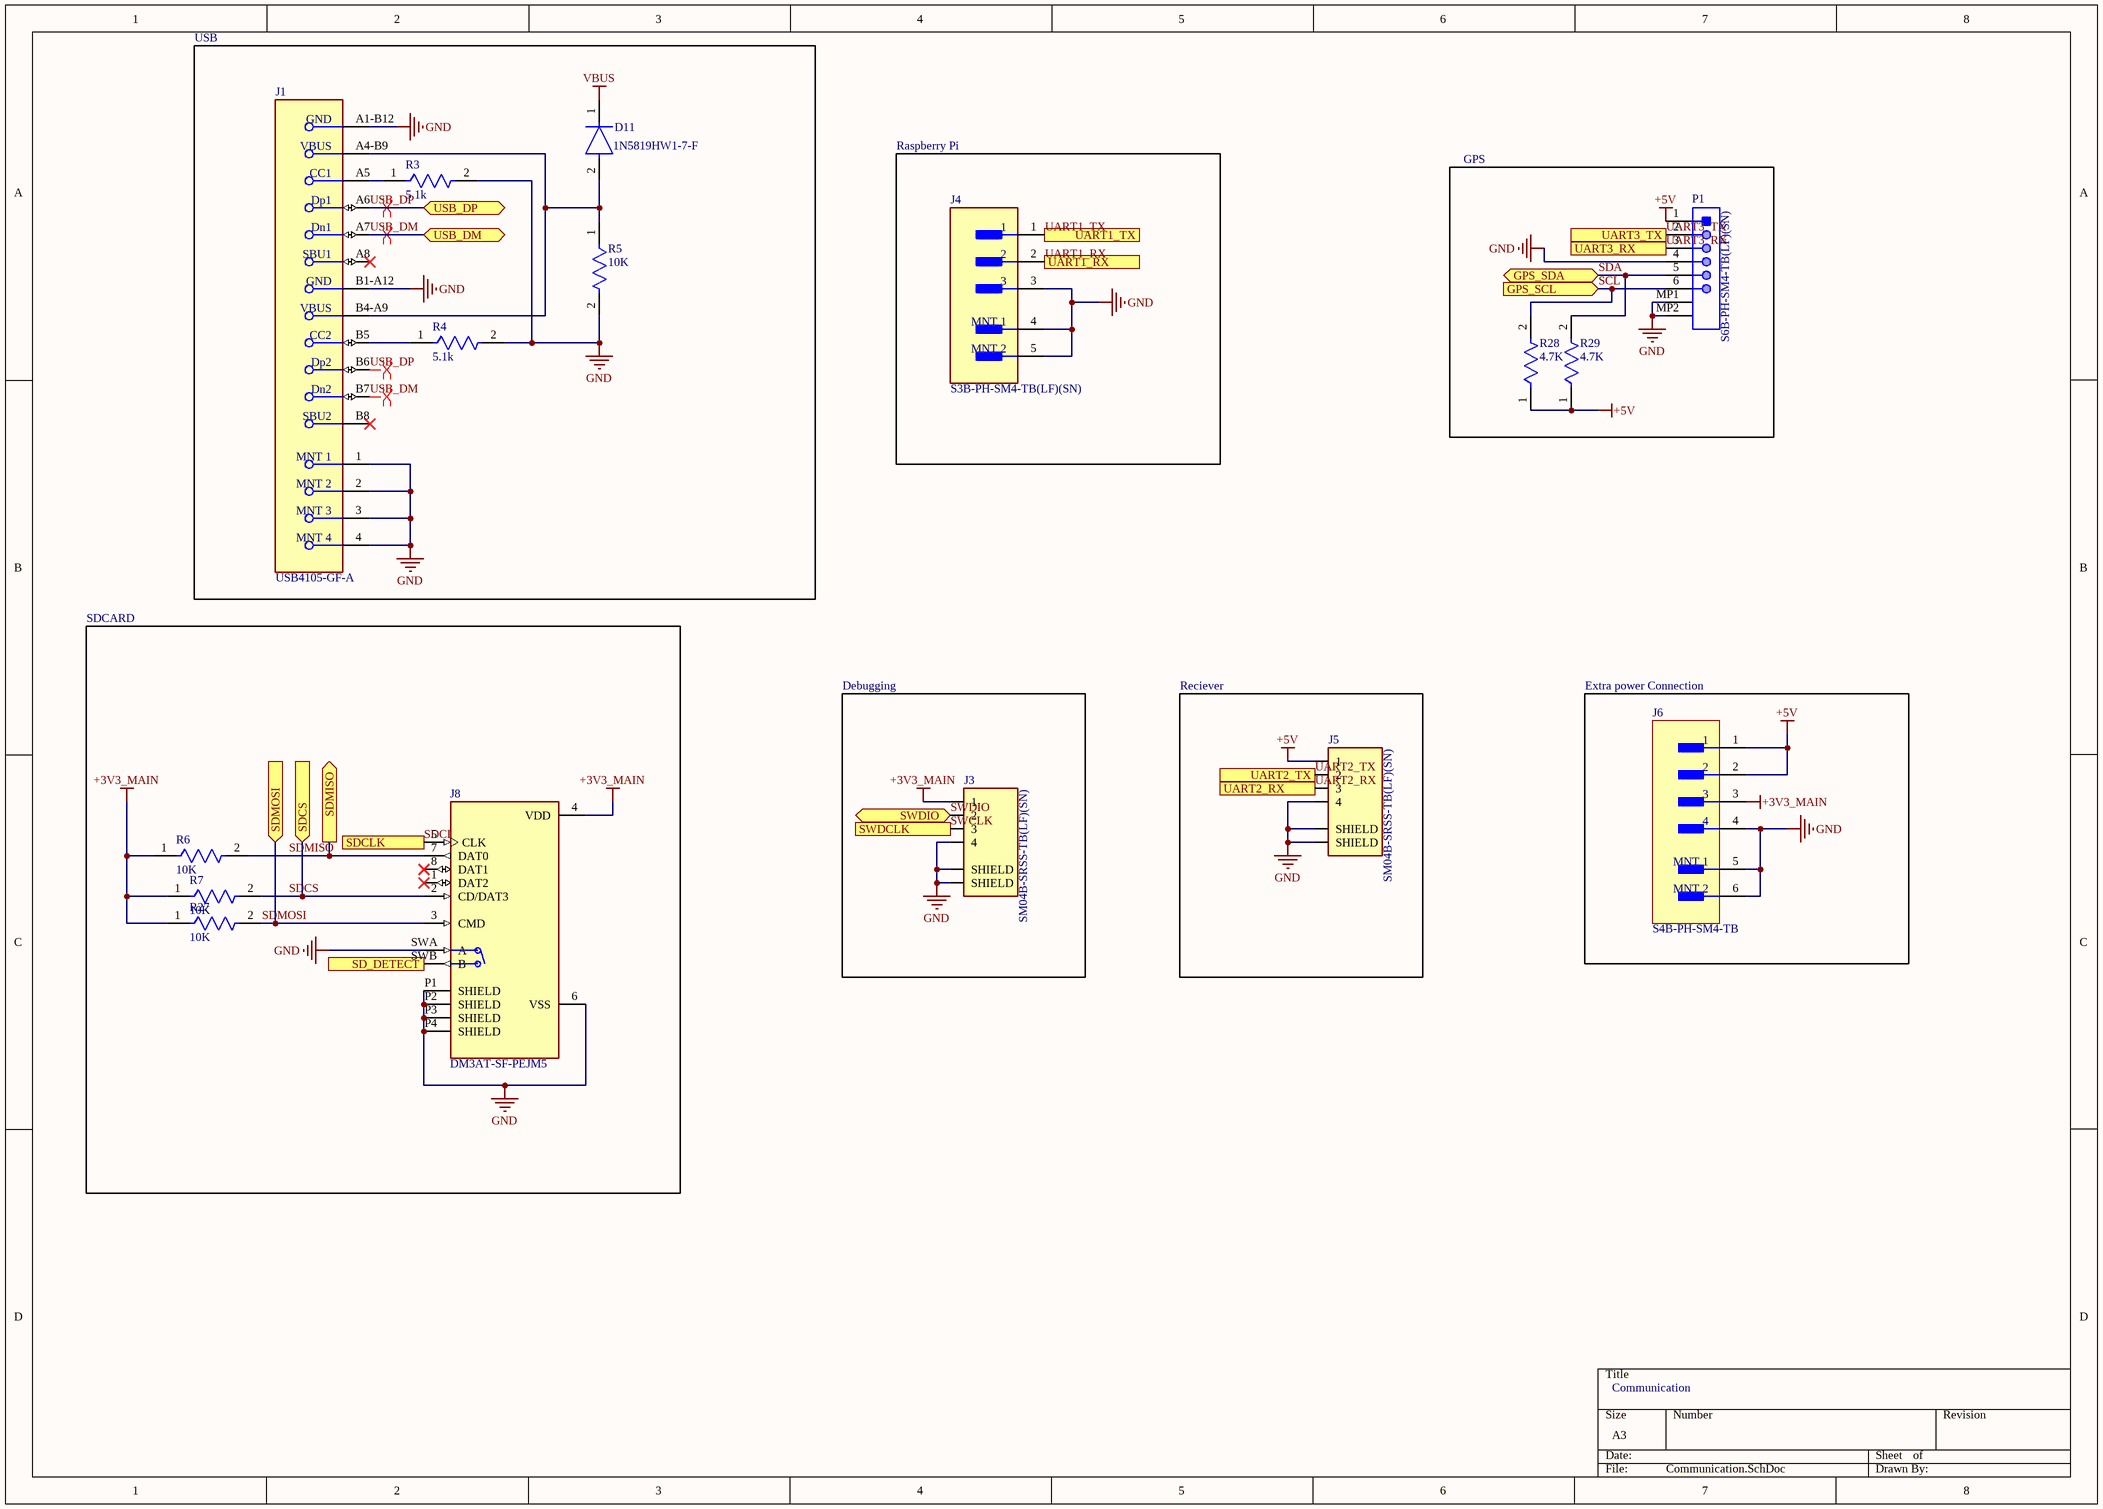
[diagram p3: Communication.SchDoc]

### Parts
D11  1N5819HW1-7-F  [FP-SOD123F_Type_B-MFG]
J1  USB4105-GF-A  [FP-USB4105-GF-A-MFG]
J3  SM04B-SRSS-TB(LF)(SN)  [JST_SM04B-SRSS-TB(LF)(SN)]
J4  S3B-PH-SM4-TB(LF)(SN)  [FP-S3B-PH-SM4-TB_LF_SN-MFG]
J5  SM04B-SRSS-TB(LF)(SN)  [JST_SM04B-SRSS-TB(LF)(SN)]
J6  S4B-PH-SM4-TB  [FP-S4B-PH-SM4-TB-MFG]
J8  DM3AT-SF-PEJM5  [HRS_DM3AT-SF-PEJM5]
P1  S6B-PH-SM4-TB(LF)(SN)  [JST-S6B-PH-SM4-TB(LF)(SN)_V]
R3  5.1k  [FP-RN73R1E-IPC_C]
R4  5.1k  [FP-RN73R1E-IPC_C]
R5  10K  [FP-MCS0402-MFG]
R6  10K  [FP-MCS0402-MFG]
R7  10K  [FP-MCS0402-MFG]
R27  10K  [FP-MCS0402-MFG]
R28  4.7K  [FP-CRCW0402-Pe3-IPC_C]
R29  4.7K  [FP-CRCW0402-Pe3-IPC_C]

### Blocks framed on the sheet
USB: D11 J1 R3-R5
Raspberry Pi: J4
GPS: P1 R28 R29
SDCARD: J8 R6 R7 R27
Debugging: J3
Reciever: J5
Extra power Connection: J6

### Ports
GPS_SCL (in, see EMP_FC_Main[3B], MCU_Core[5B]), GPS_SDA (bidir, see EMP_FC_Main[3B], MCU_Core[5B]), SD_DETECT (out, see EMP_FC_Main[3B], MCU_Core[1B]), SDCLK (in, see EMP_FC_Main[3B], MCU_Core[1B]), SDCS (in, see EMP_FC_Main[3B], MCU_Core[3B]), SDMISO (out, see EMP_FC_Main[3B], MCU_Core[1B]), SDMOSI (in, see EMP_FC_Main[3B], MCU_Core[1B]), SWDCLK (out, see EMP_FC_Main[3B], MCU_Core[4B]), SWDIO (bidir, see EMP_FC_Main[3B], MCU_Core[4B]), UART1_RX (out, see EMP_FC_Main[3B], MCU_Core[3B]), UART1_TX (in, see EMP_FC_Main[3B], MCU_Core[3B]), UART2_RX (out, see EMP_FC_Main[3B], MCU_Core[4B]), UART2_TX (in, see EMP_FC_Main[3B], MCU_Core[4B]), UART3_RX (out, see EMP_FC_Main[3B], MCU_Core[1B]), UART3_TX (in, see EMP_FC_Main[3B], MCU_Core[1B]), USB_DM (bidir, see EMP_FC_Main[3B], MCU_Core[4B]), USB_DP (bidir, see EMP_FC_Main[3B], MCU_Core[4B])

### Nets
+3V3_MAIN: J3.1 J6.3 J8.4(VDD) R6.1 R7.1 R27.1
+5V: J5.1 J6.1 J6.2 P1.1 R28.1 R29.1
GND: J1.1(MNT_1) J1.2(MNT_2) J1.3(MNT_3) J1.4(MNT_4) J1.A1-B12(GND) J1.B1-A12(GND) J3.4 J3.S1(SHIELD) J3.S2(SHIELD) J4.3 J4.4(MNT_1) J4.5(MNT_2) J5.4 J5.S1(SHIELD) J5.S2(SHIELD) J6.4 J6.5(MNT_1) J6.6(MNT_2) J8.6(VSS) J8.P1(SHIELD) J8.P2(SHIELD) J8.P3(SHIELD) J8.P4(SHIELD) J8.SWA(A) P1.4 P1.MP1 P1.MP2 R3.2 R4.2 R5.2
VBUS: D11.1(C)
SCL: P1.6 R28.2 ; port GPS_SCL  [project net GPS_SCL]
SDA: P1.5 R29.2 ; port GPS_SDA  [project net GPS_SDA]
SDCLK: J8.5(CLK) ; port SDCLK
SDCS: J8.2(CD/DAT3) R7.2 ; port SDCS
SDMISO: J8.7(DAT0) R6.2 ; port SDMISO
SDMOSI: J8.3(CMD) R27.2 ; port SDMOSI
SWCLK: J3.3 ; port SWDCLK
SWDIO: J3.2 ; port SWDIO
UART1_RX: J4.2 ; port UART1_RX
UART1_TX: J4.1 ; port UART1_TX
UART2_RX: J5.3 ; port UART2_RX
UART2_TX: J5.2 ; port UART2_TX
UART3_RX: P1.3 ; port UART3_RX
UART3_TX: P1.2 ; port UART3_TX
USB_DM: J1.A7(Dn1) J1.B7(Dn2) ; port USB_DM  [project net D_N]
USB_DP: J1.A6(Dp1) J1.B6(Dp2) ; port USB_DP  [project net D_P]
NetD11_2: D11.2(A) J1.A4-B9(VBUS) J1.B4-A9(VBUS) R5.1
NetJ1_A5: J1.A5(CC1) R3.1
NetJ1_B5: J1.B5(CC2) R4.1
NetJ8_SWB: J8.SWB(B) ; port SD_DETECT

Not connected (* = marked no-connect by the designer): J1 A8(SBU1)* B8(SBU2)*; J8 1(DAT2)* 8(DAT1)*

### Layout directives
differential pair: D_N, D_P

### Notes on the sheet
- Communication

### Library data of the parts
D11 = CMP-12791-000028-1: DIODE SBR 40V 1A SOD123F; Manufacturer: Diodes Inc.; Max Junction Temp: +125°C; Capacitance: 30pF; Value: 30pF; Peak Reverse Current: 0.5mA; Max Surge Forward Current: 30A; ComponentLink2Description: Datasheet; Temperature: -55°C to +125°C; Lead Free: Yes; Package: SOD123F (Type B); Reverse Voltage: 40V; Device Class L2: Diodes; Manufacturer Part Number: 1N5819HW1-7-F; ComponentLink2URL: https://www.diodes.com/assets/Datasheets/1N5819HW1.pdf; Automotive: No; RoHS: TRUE; Height: 1.15mm; Digikey Description: DIODE SBR 40V 1A SOD123F; Max Repetitive Reverse Voltage: 40V; Forward Current: 1A; Footprint Url: https://www.diodes.com/assets/Package-Files/SOD123F%20(Type%20B).pdf; Temperature Range High: +125°C; Octopart: https://octopart.com/1n5819hw1-7-f-diodes+inc.-67250096; Mouser Description: Schottky Diodes & Rectifiers 1A SBR 40Vrrm 0.51Vf 0.5mA 28Vrms; Device Class L3: Rectifier Diodes; Ipc Land Pattern Name: SOD350180X98-2; Device Class L1: Discrete Semiconductors; Category: Diode; Temperature Range Low: -55°C
J1 = CMP-245163-000001-1: CONN RCPT USB2.0 TYPEC 5A; Manufacturer: GCT; Description: USB - C (Type - C) USB 2.0 Receptacle Connector 24 Position Surface Mount, Right Angle; Through Hole; Voltage Rating: 20V; Is Female: yes; Current Rating: 5/6.25/1.25/0.25A; Number Of Contacts: 16; Conn Orientation: Right Angle; Device Class L1: Connectors; Category: Conn; Lead Free: Yes; RoHS: TRUE; Temperature Range High: +85°C; Digikey Description: CONN RCPT USB2.0 TYPEC 5A; Device Class L3: unset; ComponentLink2Description: Datasheet; Manufacturer Part Number: USB4105-GF-A; Package: 0; Usb Standard: USB 2.0; Device Class L2: USB Connectors; Automotive: No; Temperature Range Low: -40°C; Height: 3.46mm; Temperature: -40°C to +85°C; Contact Material: Gold,Nickel; ComponentLink2URL: https://gct.co/files/drawings/usb4105.pdf; Octopart: https://octopart.com/usb4105-gf-a-gct-106627878
J3 J5 = SM04B-SRSS-TB(LF)(SN): Connector Header Surface Mount, Right Angle 4 position 0.039 (1.00mm); MF: JST Sales; SnapEDA_Link: https://www.snapeda.com/parts/SM04B-SRSS-TB(LF)(SN)/JST/view-part/?ref=snap; Package: None; Value: *; MP: SM04B-SRSS-TB(LF)(SN); Check_prices: https://www.snapeda.com/parts/SM04B-SRSS-TB(LF)(SN)/JST/view-part/?ref=eda
J4 = CMP-2000-07023-2: CONN HEADER SMD R/A 3POS 2MM; Voltage Rating: 100V; Gender: Male; Max Current Rating: 2A; Number of Contacts: 3; Insulation Resistance: 1GR; Contact Resistance: 10mR; Termination: Solder; Orientation: Right Angle; Insulation Color: Natural; Flammability Rating: UL94 V-0; Width: 5mm; Lead Free: Lead Free; Mount: Surface Mount; Max Operating Temperature: 85°C; Connector Type: Header; Fastening Type: Detent; Max Voltage Rating (DC): 100V; Housing Material: Polyamide; Number of Rows: 1; Housing Color: Beige; Contact Plating: Tin; Contact Shape: Square; Working Voltage: 100V; Contact Material: Copper Alloy; Contact Mating Length: 0.13inch; Contact Type: Male Pin; Max Voltage Rating (AC): 100V; Packaging: Tape and Reel; Min Operating Temperature: -25°C; Number of Positions: 3; REACH SVHC: No SVHC; Contact Finish - Mating: TIN; Color: Natural; Length: 9.9mm; Insulation Material: Nylon; Depth: 7.6mm; Current Rating: 2A; Material: Polyamide; Voltage Rating (AC): 100V; Pitch: 2mm; Series: PH; Height: 9.4mm; Number of Poles: 3; Lead Pitch: 2mm
J6 = CMP-00504-08293667-1: S4B-PH-SM4-TB Header S4B-PH-SM4-TB, 2.00mm, 4-contacts, side entry, SMT, /1000/reel; Max Voltage Rating (DC): 100V; Gender: Male; Number of Contacts: 4; Pitch: 2mm; Max Current Rating: 2A; Contact Resistance: 20mΩ; Termination: Solder; Contact Plating: Copper, Tin; Max Voltage Rating (AC): 100V; Number of Pins: 4; Length: 11.9mm; Housing Color: Beige; RoHS: Non-Compliant; Voltage Rating: 100V; Depth: 7.6mm; Height: 5.5mm; Current Rating: 2A; Max Operating Temperature: 85°C; Min Operating Temperature: -25°C; Number of Rows: 1; Housing Material: Polyamide; Contact Material: Copper, Tin; Packaging: Tape and Reel
J8 = DM3AT-SF-PEJM5: 10 (8 + 2) Position Card Connector Secure Digital - microSDâ„¢ Surface Mount, Right Angle Gold; MF: Hirose; SnapEDA_Link: https://www.snapeda.com/parts/DM3AT-SF-PEJM5/Hirose+Electric+Co+Ltd/view-part/?ref=snap; Package: None; Value: *; MP: DM3AT-SF-PEJM5; Check_prices: https://www.snapeda.com/parts/DM3AT-SF-PEJM5/Hirose+Electric+Co+Ltd/view-part/?ref=eda
P1 = CMP-2000-07027-1: Male Header, Pitch 2 mm, 1 x 6 Position, Height 5.5 mm, -25 to 85 degC; Manufacturer: JST; Pitch: 2mm; Style/Orientation: RightAngleHeader/Plug; No of Positions: 6; Package Reference: S6B-PH-SM4-TB(LF)(SN); Type: ShroudedHeader; Package Description: Male Header, Pitch 2 mm, 1 x 6 Position, Height 5.5 mm; Mounting Technology: SurfaceMount; Datasheet Version: 11/2008; Termination: Solder; Datasheet URL: https://datasheet.ciiva.com/11747/0900766b80df0d9d-11747278.pdf; Manufacturer URL: http://www.jst.com/home2.html
R3 R4 = CMP-04015-008529-1: 5.1kΩ ±1% 0.063W, 1/16W Chip Resistor 0402 (1005 Metric) Moisture Resistant Thin Film
R5-R7 R27 = CMP-02407-000363-1: as R12 on sheet MCU_Core; Package Quantity: 10000; Case Code (Metric): 1005; Height: 0.015inch; Termination: SMD/SMT; Features: Automotive AEC-Q200; Packaging: Tape and Reel; Length: 0.039inch; Min Operating Temperature: -55°C; Case/Package: 0402; Max Power Dissipation: 100mW; Case Code (Imperial): 0402; Width: 0.5mm; Contact Plating: Tin; Weight: 2.1E-05oz; Max Operating Temperature: 175°C; Composition: Thin Film; Number of Terminations: 2; Radiation Hardening: No
R28 R29 = CMP-03613-000096-1: as R19 on sheet MCU_Core; Tolerance: 1%; Package Quantity: 10000; Case/Package: 0402; Max Operating Temperature: 155°C; RoHS Compliant: Yes; Series: CRCW-P; Resistor Type: Thick Film; Number of Terminations: 2; Min Operating Temperature: -55°C; Temperature Coefficient: 50ppm/°C; Features: Automotive AEC-Q200; Length: 0.039inch; Height: 0.016inch; Width: 0.02inch; Packaging: Tape and Reel

## Sheet Motor_Outputs.SchDoc
size A4; SheetNumber: 5; SheetTotal: 5
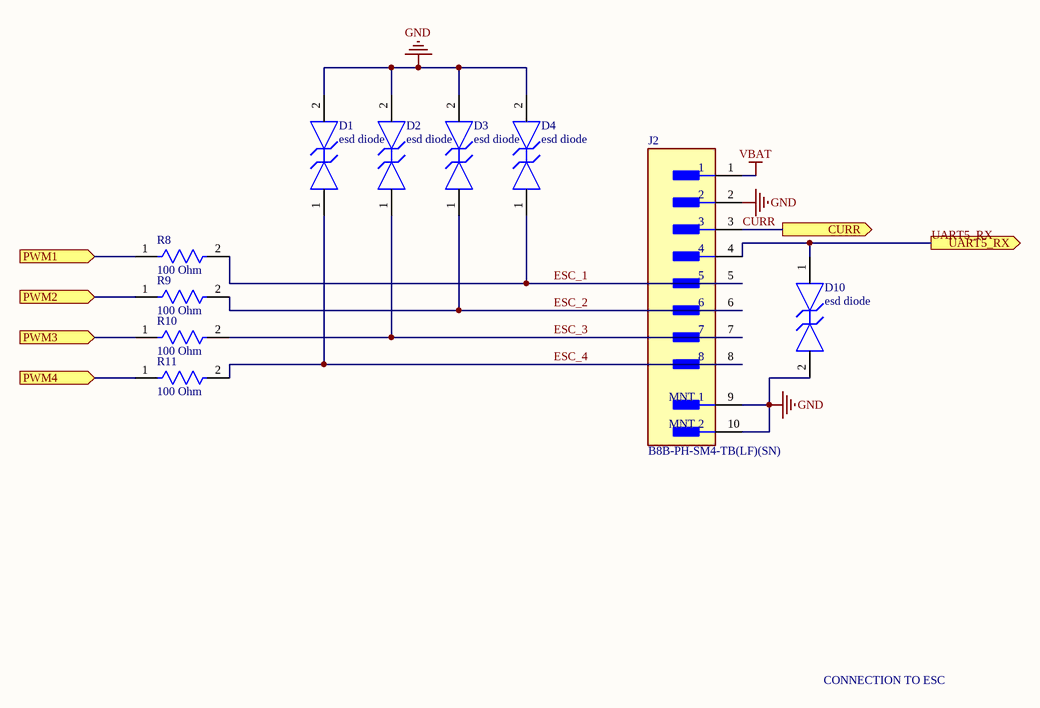
[diagram p4: Motor_Outputs.SchDoc]

### Parts
D1  esd diode  [FP-152AF-MFG]
D2  esd diode  [FP-152AF-MFG]
D3  esd diode  [FP-152AF-MFG]
D4  esd diode  [FP-152AF-MFG]
D10  esd diode  [FP-152AF-MFG]
J2  B8B-PH-SM4-TB(LF)(SN)  [FP-B8B-PH-SM4-TB_LF_SN-MFG]
R8  100 Ohm  [FP-MCS0402-IPC_A]
R9  100 Ohm  [FP-MCS0402-IPC_A]
R10  100 Ohm  [FP-MCS0402-IPC_A]
R11  100 Ohm  [FP-MCS0402-IPC_A]

### Ports
CURR (out, see EMP_FC_Main[2C], MCU_Core[5B]), PWM1 (in, see EMP_FC_Main[2C], MCU_Core[2B]), PWM2 (in, see EMP_FC_Main[2C], MCU_Core[2B]), PWM3 (in, see EMP_FC_Main[2C], MCU_Core[2B]), PWM4 (in, see EMP_FC_Main[2C], MCU_Core[2B]), UART5_RX (out, see EMP_FC_Main[2C], MCU_Core[1B])

### Nets
GND: D1.2 D2.2 D3.2 D4.2 D10.2 J2.2 J2.9(MNT_1) J2.10(MNT_2)
VBAT: J2.1
CURR: J2.3 ; port CURR
ESC_1: D4.1 J2.5 R8.2
ESC_2: D3.1 J2.6 R9.2
ESC_3: D2.1 J2.7 R10.2
ESC_4: D1.1 J2.8 R11.2
UART5_RX: D10.1 J2.4 ; port UART5_RX
NetR8_1: R8.1 ; port PWM1
NetR9_1: R9.1 ; port PWM2
NetR10_1: R10.1 ; port PWM3
NetR11_1: R11.1 ; port PWM4

### Notes on the sheet
- CONNECTION TO ESC

### Library data of the parts
D1-D4 D10 = CMP-07200-000010-1: TVS DIODE 5.3V 14V 2X3DFN; Number of Bidirectional Channels: 1; Element Configuration: Single; Capacitance: 0.3pF; Peak Pulse Current: 3A; Power Line Protection: No; Min Breakdown Voltage: 7V; Direction: Bidirectional; Case/Package: DFN; Lead Free: Lead Free; Reverse Standoff Voltage: 5.3V; Clamping Voltage: 14V; Resistor Type: Zener; Packaging: Tape and Reel; Mount: Surface Mount; Number of Pins: 2; Max Operating Temperature: 150°C; Min Operating Temperature: -55°C; Working Voltage: 5.3V; RoHS Compliant: Yes
J2 = CMP-17439-000195-1: CONN HEADER SMD 8POS 2MM; Current Rating: 2A; Insulation Resistance: 1GR; Mated Stacking Heights: 8.6mm; Gender: Male; Contact Resistance: 20mR; Number of Contacts: 8; Max Voltage Rating (AC): 100V; Pitch: 2mm; Fastening Type: Detent; Min Operating Temperature: -25°C; Contact Type: Male Pin; Series: PH; Contact Material: Copper Alloy; Termination: Solder; Contact Shape: Square; Depth: 5mm; Insulation Color: Natural; Housing Material: Polyamide; Max Current Rating: 2A; Color: White; Connector Type: Header; REACH SVHC: No SVHC; Insulation Material: Nylon; Number of Positions: 8; Height: 9.4mm; Width: 5.5mm; Max Operating Temperature: 85°C; Mount: Surface Mount; Orientation: Straight; Packaging: Tape and Reel; Working Voltage: 100V; Contact Mating Length: 0.13inch; Voltage Rating (AC): 100V; Housing Color: Beige; Length: 19.95mm; Contact Plating: Tin; Number of Poles: 8; Lead Free: Lead Free; Voltage Rating: 100V; Lead Pitch: 2mm; Contact Finish - Mating: TIN; Flammability Rating: UL94 V-0; Number of Rows: 1
R8-R11 = CMP-02407-000150-1: RES SMD 1.2K OHM 1% 1/10W 0402; Resistance: 100R; Max Power Dissipation: 200mW; Tolerance: 0.5%; Temperature Coefficient: 25ppm/°C; Packaging: Cut Tape; Min Operating Temperature: -55°C; Case Code (Imperial): 0402; Features: Automotive AEC-Q200; Case/Package: 0402; Number of Terminations: 2; Max Operating Temperature: 175°C; Composition: Thin Film; Case Code (Metric): 1005

## Nets that join several sheets
+3V3_ANALOG: Power_Management (C49.1 U12.5), MCU_Core (24 pins)
+3V3_MAIN: Power_Management (7 pins), MCU_Core (20 pins), Communication (6 pins)
+5V: Power_Management (7 pins), Communication (6 pins)
GND: Power_Management (27 pins), MCU_Core (49 pins), Communication (30 pins), Motor_Outputs (8 pins)
VBAT: Power_Management (7 pins), Motor_Outputs (J2.1)
VBUS: Power_Management (U9.3 U11.1), Communication (D11.1)
CURR: MCU_Core (U2.35), Motor_Outputs (J2.3)
D_N: MCU_Core (U2.70), Communication (J1.A7 J1.B7)
D_P: MCU_Core (U2.71), Communication (J1.A6 J1.B6)
GPS_SCL: MCU_Core (U2.46), Communication (P1.6 R28.2)
GPS_SDA: MCU_Core (U2.47), Communication (P1.5 R29.2)
NetJ8_SWB: MCU_Core (U2.88), Communication (J8.SWB)
NetR8_1: MCU_Core (U2.59), Motor_Outputs (R8.1)
NetR9_1: MCU_Core (U2.60), Motor_Outputs (R9.1)
NetR10_1: MCU_Core (U2.61), Motor_Outputs (R10.1)
NetR11_1: MCU_Core (U2.62), Motor_Outputs (R11.1)
NetU2_98: Power_Management (U7.1), MCU_Core (U2.98)
SDCLK: MCU_Core (U2.84), Communication (J8.5)
SDCS: MCU_Core (U2.2), Communication (J8.2 R7.2)
SDMISO: MCU_Core (U2.85), Communication (J8.7 R6.2)
SDMOSI: MCU_Core (U2.86), Communication (J8.3 R27.2)
SWCLK: MCU_Core (U2.76), Communication (J3.3)
SWDIO: MCU_Core (U2.72), Communication (J3.2)
UART1_RX: MCU_Core (U2.37), Communication (J4.2)
UART1_TX: MCU_Core (U2.38), Communication (J4.1)
UART2_RX: MCU_Core (U2.25), Communication (J5.3)
UART2_TX: MCU_Core (U2.24), Communication (J5.2)
UART3_RX: MCU_Core (U2.56), Communication (P1.3)
UART3_TX: MCU_Core (U2.55), Communication (P1.2)
UART5_RX: MCU_Core (U2.87), Motor_Outputs (D10.1 J2.4)